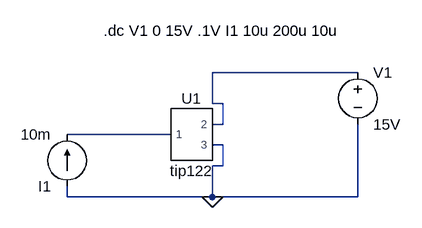
[diagram p0: schematic Transistor charactersitics TIP122.asc]
Transistor charactersitics TIP122.asc, the LTspice schematic file:
Version 4
SHEET 1 880 680
WIRE 464 96 240 96
WIRE 240 144 240 96
WIRE 256 144 240 144
WIRE 256 176 256 144
WIRE 256 176 240 176
WIRE 176 192 16 192
WIRE 256 208 240 208
WIRE 256 240 256 208
WIRE 256 240 240 240
WIRE 16 288 16 272
WIRE 240 288 240 240
WIRE 240 288 16 288
WIRE 464 288 464 176
WIRE 464 288 240 288
FLAG 240 288 0
SYMBOL voltage 464 80 R0
WINDOW 123 0 0 Left 2
WINDOW 39 0 0 Left 2
SYMATTR InstName V1
SYMATTR Value 15V
SYMBOL current 16 272 R180
WINDOW 123 0 0 Left 2
WINDOW 39 0 0 Left 2
SYMATTR InstName I1
SYMATTR Value 10m
SYMBOL AutoGenerated\\tip122 208 192 R0
SYMATTR InstName U1
TEXT 72 32 Left 2 !.dc V1 0 15V .1V I1 10u 200u 10u

The netlist it stands for:
* Transistor charactersitics TIP122.asc
V1 N001 0 15V
I1 0 N002 10m
XU1 N002 N001 0 tip122  ; pins 1 2 3
.dc V1 0 15V .1V I1 10u 200u 10u
.lib F:\electronics\LTspiceIV\mycircuits\TIP122.SP3
.backanno
.end